# Altium schematic sheet Solar System.SchDoc
size A4; SheetNumber: 1; SheetTotal: 1
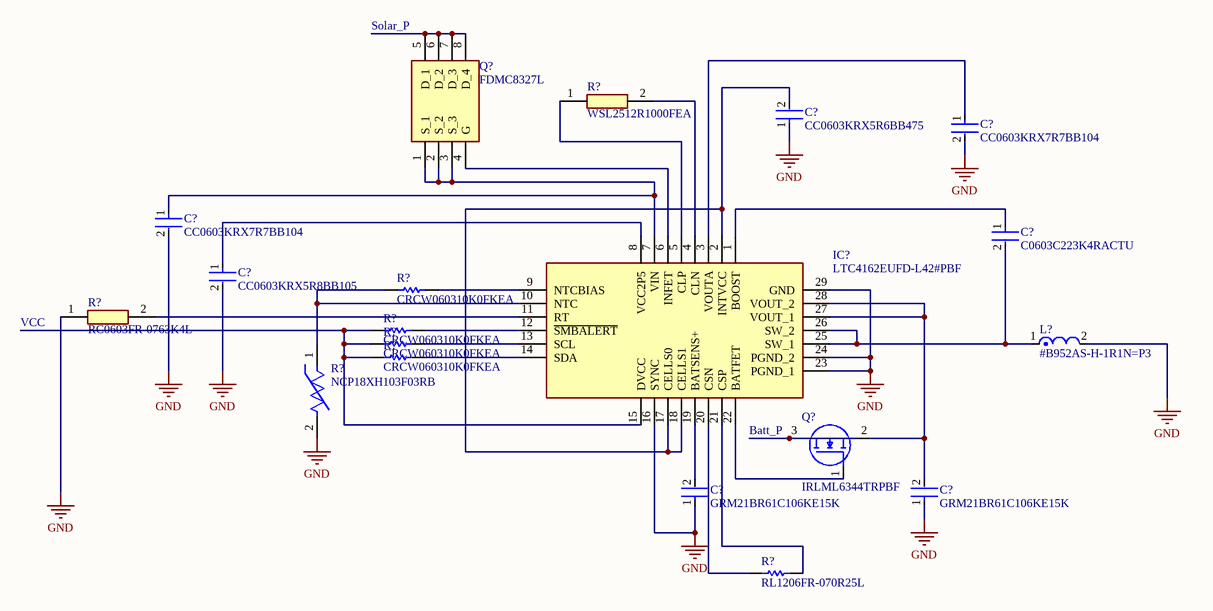
[diagram p0: Solar System.SchDoc]

## Parts
(Parts that share a designator on the sheet are numbered #1, #2 ... from top to bottom, then left to right.)
C?#1  CC0603KRX7R7BB104  [FP-CC0603-DA-MFG]
C?#2  CC0603KRX5R6BB475  [FP-CC0603-DA-MFG]
C?#3  CC0603KRX7R7BB104  [FP-CC0603-DA-MFG]
C?#4  C0603C223K4RACTU  [FP-C0603C-CF-MFG]
C?#5  CC0603KRX5R8BB105  [FP-CC0603-DA-MFG]
C?#6  GRM21BR61C106KE15K  [FP-GRM21B-0_1-MFG]
C?#7  GRM21BR61C106KE15K  [FP-GRM21B-0_1-MFG]
IC?  LTC4162EUFD-L42#PBF  [QFN50P400X500X80-29N-D]
L?  #B952AS-H-1R1N=P3  [FP-DS104C2-MFG]
Q?#1  FDMC8327L  [FDMC86139P]
Q?#2  IRLML6344TRPBF  [SOT95P237X112-3N]
R?#1  WSL2512R1000FEA  [RESC6432X89N]
R?#2  CRCW060310K0FKEA  [RESC1609X50X30NL8T20]
R?#3  RC0603FR-0763K4L  [RESC1608X55N]
R?#4  CRCW060310K0FKEA  [RESC1609X50X30NL8T20]
R?#5  NCP18XH103F03RB  [FP-NCP18-0_15-IPC_A]
R?#6  CRCW060310K0FKEA  [RESC1609X50X30NL8T20]
R?#7  CRCW060310K0FKEA  [RESC1609X50X30NL8T20]
R?#8  RL1206FR-070R25L  [RESC3116X65X40LL10T20]

## Nets
GND: C?#1.2 C?#2.1 C?#3.2 C?#5.2 C?#6.1 C?#7.1 IC?.16(SYNC) IC?.23(PGND_1) IC?.24(PGND_2) IC?.29(GND) L?.2 R?#3.1 R?#5.2
NetC?#1_1: C?#1.1 IC?.3(VOUTA)
NetC?#2_2: C?#2.2 IC?.2(INTVCC) IC?.17(CELLS0) IC?.18(CELLS1)
NetC?#3_1: C?#3.1 IC?.7(VIN) Q?#1.1(S_1) Q?#1.2(S_2) Q?#1.3(S_3)
NetC?#4_1: C?#4.1 IC?.1(BOOST)
NetC?#4_2: C?#4.2 IC?.25(SW_1) IC?.26(SW_2) L?.1
NetC?#5_1: C?#5.1 IC?.8(VCC2P5)
NetC?#6_2: C?#6.2 IC?.19(BATSENS+)
NetC?#7_2: C?#7.2 IC?.27(VOUT_1) IC?.28(VOUT_2) Q?#2.2(S)
NetIC?_4: IC?.4(CLN) R?#1.2
NetIC?_5: IC?.5(CLP) R?#1.1
NetIC?_6: IC?.6(INFET) Q?#1.4(G)
NetIC?_9: IC?.9(NTCBIAS) R?#2.2
NetIC?_10: IC?.10(NTC) R?#2.1 R?#5.1
NetIC?_11: IC?.11(RT) R?#3.2
NetIC?_12: IC?.12(~{SMBALERT}) R?#4.2
NetIC?_13: IC?.13(SCL) R?#6.2
NetIC?_14: IC?.14(SDA) R?#7.2
NetIC?_15: IC?.15(DVCC) R?#4.1 R?#6.1 R?#7.1
NetIC?_20: IC?.20(CSN) R?#8.1
NetIC?_21: IC?.21(CSP) R?#8.2
NetIC?_22: IC?.22(BATFET) Q?#2.1(G)
NetQ?#1_5: Q?#1.5(D_1) Q?#1.6(D_2) Q?#1.7(D_3) Q?#1.8(D_4)

Not connected (* = marked no-connect by the designer): Q?#2 3(D)

## Notes on the sheet
- (near Q?#1) Solar_P
- (near R?#3) VCC
- Batt_P

## Library data of the parts
C?#1 C?#3 = CMP-2000-05002-2: CAP CER 0.1UF 16V X7R 0603; Manufacturer: YAGEO; Tolerance: 0.1; Value: 100 nF; Temperature Coefficient: 15%; Description: CC0603 100 nF X7R 10.00% 16 V; Material: Ceramic; Voltage Rating: 16 V; Package: CC0603-DA; ComponentLink2Description: Datasheet; Octopart: https://octopart.com/cc0603krx7r7bb104-yageo-192941; Temperature Range High: +125°C; Digikey Description: CAP CER 0.1UF 16V X7R 0603; Voltage: 16 V; Device Class L2: Capacitors; Height: 0.9mm; Temperature: -55°C to +125°C; Manufacturer Part Number: CC0603KRX7R7BB104; Device Class L1: Passive Components; Device Class L3: Ceramic Capacitors; ComponentLink2URL: http://www.yageo.com/documents/recent/UPY-GPHC_X7R_6.3V-to-50V_18.pdf; Footprint Url: http://www.yageo.com/exep/pages/download/literatures/UPY-C_GEN_24.pdf; RoHS: TRUE; Temperature Range Low: -55°C; Temperature Characteristic: X7R; Lead Free: Yes; Capacitance: 100 nF; Category: Cap; Mouser Description: Multilayer Ceramic Capacitor, CC Series, 0.1 - F, - 10%, X7R, 16 V, 0603 [1608 Metric]; Automotive: No
C?#2 = CMP-2000-06074-2: CAP CER 4.7UF 10V X5R 0603; Manufacturer: YAGEO; Description: CC0603 4.7 uF X5R 10.00% 10 V; Temperature Coefficient: 15%; Tolerance: 0.1; Material: Ceramic; Voltage Rating: 10 V; ComponentLink2URL: http://www.yageo.com/documents/recent/UPY-GPHC_X7R_6.3V-to-50V_18.pdf; Package: CC0603-DA; Temperature Range High: +125°C; Category: Cap; ComponentLink2Description: Datasheet; Lead Free: Yes; Mouser Description: 4.7µF Surface Mount, MLCC 0603 (1608 Metric) Package Ceramic Capacitors; Manufacturer Part Number: CC0603KRX5R6BB475; Device Class L2: Capacitors; Temperature Characteristic: X5R; Voltage: 10 V; RoHS: TRUE; Octopart: https://octopart.com/cc0603krx5r6bb475-yageo-9292507; Automotive: No; Height: 0.9mm; Temperature: -55°C to +125°C; Temperature Range Low: -55°C; Value: 4.7 uF; Digikey Description: CAP CER 4.7UF 10V X5R 0603; Device Class L1: Passive Components; Capacitance: 4.7 uF; Footprint Url: http://www.yageo.com/exep/pages/download/literatures/UPY-C_GEN_24.pdf; Device Class L3: Ceramic Capacitors
C?#4 = CMP-2006-03139-2: Ceramic Capacitor 0.022Uf 16V, X7R, 10%, 0603, Full Reel; Manufacturer: KEMET; Description: C0603 22,000 pF X7R 30ppm/°C 10.00% 16 V; Capacitance: 22,000 pF; Temperature Coefficient: 30ppm/°C; Automotive Grade: Grade 1; Value: 22,000 pF; Tolerance: 0.1; Category: Cap; RoHS: TRUE; Temperature Range High: +125°C; Octopart: https://octopart.com/c0603c223k4ractu-kemet-123286; Manufacturer Part Number: C0603C223K4RACTU; Mouser Description: CAP CER 0.022UF 16V X7R 0603; Voltage Rating: 16 V; Device Class L1: Passive Components; Automotive: Yes; Height: 0.87mm; Device Class L3: Ceramic Capacitors; Package: C0603C-CF; Temperature Characteristic: X7R; Device Class L2: Capacitors; Material: Ceramic; Lead Free: Yes; ComponentLink2URL: https://api.kemet.com/component-edge/download/datasheet/C0603C100J5GACAUTO.pdf; Temperature Range Low: -55°C; Digikey Description: Ceramic Capacitor 0.022Uf 16V, X7R, 10%, 0603, Full Reel; Temperature: -55°C to +125°C; ComponentLink2Description: Datasheet
C?#5 = CMP-03422-000612-1: CAP CER 1UF 25V X5R 0603; Manufacturer: YAGEO; Description: CC0603 1 uF X5R 10.00% 25 V; Material: Ceramic; Tolerance: 0.1; Temperature Coefficient: 15%; Automotive: No; Octopart: https://octopart.com/cc0603krx5r8bb105-yageo-9292811; Package: CC0603-DA; Temperature Range High: +125°C; Digikey Description: CAP CER 1UF 25V X5R 0603; Mouser Description: Multilayer Ceramic Capacitors MLCC - SMD/SMT 1.0uF 25V X5R 10%; Device Class L2: Capacitors; Category: Cap; Value: 1 uF; Temperature: -55°C to +125°C; ComponentLink2URL: http://www.yageo.com/documents/recent/UPY-GPHC_X7R_6.3V-to-50V_18.pdf; Capacitance: 1 uF; ComponentLink2Description: Datasheet; Voltage: 25 V; Manufacturer Part Number: CC0603KRX5R8BB105; Height: 0.9mm; Device Class L3: Ceramic Capacitors; Temperature Characteristic: X5R; Footprint Url: http://www.yageo.com/exep/pages/download/literatures/UPY-C_GEN_24.pdf; Temperature Range Low: -55°C; Device Class L1: Passive Components; Voltage Rating: 25 V; Lead Free: Yes; RoHS: TRUE
C?#6 C?#7 = CMP-2007-03534-2: Chip Multilayer Ceramic Capacitors for General Purpose, 0805, 10uF, X5R, 15%, 10%, 16V; Case Code (Imperial): 0805; Packaging: Tape and Reel; Width: 0.049inch; Depth: 1.25mm; Voltage Rating: 16V; Height: 1.25mm; Case/Package: 0805; Max Operating Temperature: 85°C; Min Operating Temperature: -55°C; Tolerance: 10%; Dielectric: X5R; REACH SVHC: No SVHC; Mount: Surface Mount; Radiation Hardening: No; Case Code (Metric): 2012; Length: 2mm; Package Quantity: 10000; Voltage Rating (DC): 16V; Voltage: 16V; Capacitance: 10uF; Thickness: 0.053inch; Termination: SMD/SMT
IC? = LTC4162EUFD-L42#PBF: Integrated Circuit; Manufacturer_Name: Analog Devices; Datasheet Link: https://www.analog.com/media/en/technical-documentation/data-sheets/LTC4162-L.pdf; Height: 0.8mm; Manufacturer_Part_Number: LTC4162EUFD-L42#PBF; Mouser Part Number: 584-4162EUFDL42PB; Mouser Price/Stock: https://www.mouser.co.uk/ProductDetail/Analog-Devices/LTC4162EUFD-L42PBF?qs=MLItCLRbWsz3JPFW5UIzwg%3D%3D; Arrow Part Number: LTC4162EUFD-L42#PBF; Arrow Price/Stock: https://www.arrow.com/en/products/ltc4162eufd-l42pbf/analog-devices?region=nac
L? = CMP-06042-014464-1: Shielded Wirewound Inductor 1.1uH 30% 6000mA 0.011Ω SMD; Saturation Current: 11.7A; Test Frequency: 100kHz; DC Resistance (DCR): 11mR; Core Material: Ferrite; Current Rating: 6A; Mount: Surface Mount; Max Operating Temperature: 85°C; Shielding: Shielded; Tolerance: 30%; Length: 0.409inch; Packaging: Tape and Reel; Inductance: 1.1uH; Case/Package: Nonstandard; Resistor Type: Wirewound; Min Operating Temperature: -40°C; Width: 0.409inch; Height - Seated (Max): 0.19inch
Q?#1 = FDMC8327L: MOSFET (N-Channel); Manufacturer_Name: onsemi; Datasheet Link: https://www.onsemi.com/pub/Collateral/FDMC8327L-D.pdf; Manufacturer_Part_Number: FDMC8327L; Mouser Part Number: 512-FDMC8327L; Mouser Price/Stock: https://www.mouser.co.uk/ProductDetail/onsemi-Fairchild/FDMC8327L?qs=WCuZTSj0%252BHDvMqCYzCnZnA%3D%3D; Arrow Part Number: FDMC8327L; Arrow Price/Stock: https://www.arrow.com/en/products/fdmc8327l/on-semiconductor?utm_currency=USD&region=nac
Q?#2 = IRLML6344TRPBF: MOSFET (N-Channel); Manufacturer_Name: Infineon; Datasheet Link: https://www.infineon.com/dgdl/irlml6344pbf.pdf?fileId=5546d462533600a4015356689c44262c; Height: 1.12mm; Manufacturer_Part_Number: IRLML6344TRPBF; Mouser Part Number: 942-IRLML6344TRPBF; Mouser Price/Stock: https://www.mouser.co.uk/ProductDetail/Infineon-Technologies/IRLML6344TRPBF?qs=9%252BKlkBgLFf2w4qS48UOXVw%3D%3D; Arrow Part Number: IRLML6344TRPBF; Arrow Price/Stock: https://www.arrow.com/en/products/irlml6344trpbf/infineon-technologies-ag?utm_currency=USD&region=nac
R?#1 = WSL2512R1000FEA: Resistor; Manufacturer_Name: Vishay; Datasheet Link: http://www.farnell.com/datasheets/2049120.pdf; Height: 0.889mm; Manufacturer_Part_Number: WSL2512R1000FEA; Mouser Part Number: 71-WSL2512R1000FEA; Mouser Price/Stock: https://www.mouser.co.uk/ProductDetail/Vishay-Dale/WSL2512R1000FEA?qs=ViWNInbc%252BeVuqDCpvibv1w%3D%3D; Arrow Part Number: WSL2512R1000FEA; Arrow Price/Stock: https://www.arrow.com/en/products/wsl2512r1000fea/vishay?utm_currency=USD&region=europe
R?#2 R?#4 R?#6 R?#7 = CMP-1666-00005-4: Chip Resistor, 10 KOhm, +/- 1%, 100 mW, -55 to 155 degC, 0603 (1608 Metric), RoHS, Tape and Reel; Manufacturer: Vishay Semiconductor; Voltage Rating: 75 V; Max Operating Temperature: 155 degC; PackageDescription: 2-Pin Surface Mount Device, Body 1.575 x 0.85 mm; ComponentLink1Description: Manufacturer URL; RoHSCompliant: true; PackageReference: 0603; REACH SVHC: Unknown; Length: 1.55 mm; DatasheetVersion: 06/2012; Packaging: Tape and Reel; Min Operating Temperature: -55 degC; Mounting Technology: Surface Mount; ComponentLink2URL: https://datasheet.ciiva.com/11809/0900766b80d98afc-11809037.pdf; Height: 0.45 mm; ComponentLink2Description: Datasheet; Package Quantity: 5000; ComponentLink1URL: http://www.vishay.com/
R?#3 = RC0603FR-0763K4L: Resistor; Manufacturer_Name: KEMET; Datasheet Link: http://www.yageo.com/documents/recent/PYu-RC0603_51_RoHS_L_v5.pdf; Height: 0.55mm; Manufacturer_Part_Number: RC0603FR-0763K4L; Mouser Part Number: 603-RC0603FR-0763K4L; Mouser Price/Stock: https://www.mouser.co.uk/ProductDetail/Yageo/RC0603FR-0763K4L?qs=bK2T7AVO1ye5WfXmb5QR%252Bw%3D%3D; Arrow Part Number: RC0603FR-0763K4L; Arrow Price/Stock: https://www.arrow.com/en/products/rc0603fr-0763k4l/yageo
R?#5 = CMP-2000-05271-3: NTC Thermistor for Temperature Sensor, 0603, 10kΩ, 1%, 0.1mA, 5V; Manufacturer Series: NCP18; Accuracy: 0.7%; Current Rating: 310uA; Max Power Dissipation: 100mW; Thermistor Application: TEMPERATURE COMPENSATION; Number of Terminals/Pins: 2; Resistance: 10kR; Case Code (Metric): 1608; RoHS Compliant: Yes; Max Operating Temperature: 125°C; Resistance Tolerance: 1%; Case/Package: 0603; Mount: Surface Mount; Lead Free: Lead Free; Min Operating Temperature: -40°C; REACH SVHC: No SVHC; Package Shape: Rectangular; Radiation Hardening: No; Series: NCP; Depth: 0.8mm; Number of Pins: 2; Length: 1.6mm; Height: 0.8mm; Terminal Placement: Dual; Tolerance: 1%; Case Code (Imperial): 0603; Terminal Finish: Tin; Power Rating: 100mW; Termination: SMD/SMT; Packaging: Tape and Reel; Package Quantity: 1
R?#8 = CMP-2003-04044-1: Manufacturer: Yageo; Part Number: RL1206FR-070R25L